# Altium schematic sheet power.SchDoc
size Letter
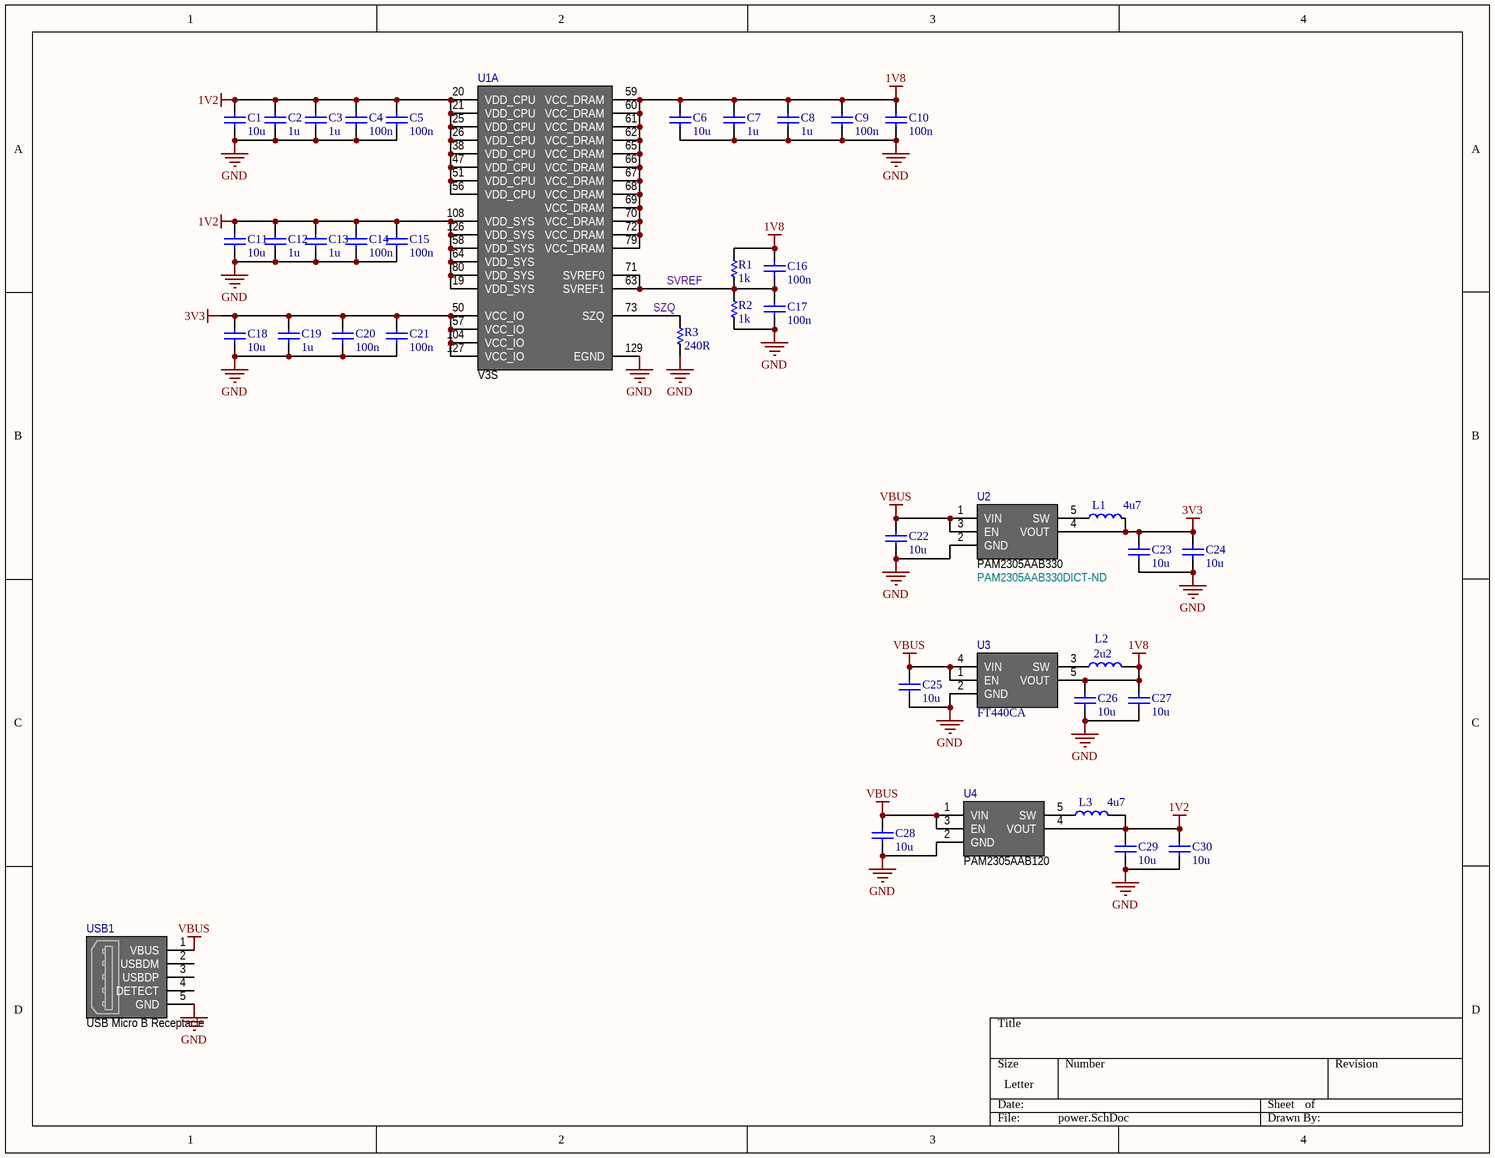
[diagram p0: power.SchDoc]

## Parts
C1  10u  [CAPC1608N]
C2  1u  [CAPC1005N]
C3  1u  [CAPC1005N]
C4  100n  [CAPC1005N]
C5  100n  [CAPC1005N]
C6  10u  [CAPC1608N]
C7  1u  [CAPC1005N]
C8  1u  [CAPC1005N]
C9  100n  [CAPC1005N]
C10  100n  [CAPC1005N]
C11  10u  [CAPC1608N]
C12  1u  [CAPC1005N]
C13  1u  [CAPC1005N]
C14  100n  [CAPC1005N]
C15  100n  [CAPC1005N]
C16  100n  [CAPC1005N]
C17  100n  [CAPC1005N]
C18  10u  [CAPC1608N]
C19  1u  [CAPC1005N]
C20  100n  [CAPC1005N]
C21  100n  [CAPC1005N]
C22  10u  [CAPC1608N]
C23  10u  [CAPC1608N]
C24  10u  [CAPC1608N]
C25  10u  [CAPC1608N]
C26  10u  [CAPC1608N]
C27  10u  [CAPC1608N]
C28  10u  [CAPC1608N]
C29  10u  [CAPC1608N]
C30  10u  [CAPC1608N]
L1  value 4u7  [INDC2520X12N]  (hidden comment: Inductor)
L2  value 2u2  [INDC2520X12N]  (hidden comment: Inductor)
L3  value 4u7  [INDC2520X12N]  (hidden comment: Inductor)
R1  1k  [RESC1005N]
R2  1k  [RESC1005N]
R3  240R  [RESC1005N]
U1  V3S  [V3S]  (part A of 10)
U2  PAM2305AAB330  Supplier Part Number 1: PAM2305AAB330DICT-ND  [TSOT25-5N]
U3  FT440CA  [SOT23-5AN]
U4  PAM2305AAB120  [TSOT25-5N]
USB1  USB Micro B Receptacle  [10118193-0001LF]

## Nets
1V2: C1.2 C2.2 C3.2 C4.2 C5.2 C11.2 C12.2 C13.2 C14.2 C15.2 C29.2 C30.2 L3.2 U1.19(VDD_SYS) U1.20(VDD_CPU) U1.21(VDD_CPU) U1.25(VDD_CPU) U1.26(VDD_CPU) U1.38(VDD_CPU) U1.47(VDD_CPU) U1.51(VDD_CPU) U1.56(VDD_CPU) U1.58(VDD_SYS) U1.64(VDD_SYS) U1.80(VDD_SYS) U1.108(VDD_SYS) U1.126(VDD_SYS) U4.4(VOUT)
1V8: C6.2 C7.2 C8.2 C9.2 C10.2 C16.2 C26.2 C27.2 L2.2 R1.2 U1.59(VCC_DRAM) U1.60(VCC_DRAM) U1.61(VCC_DRAM) U1.62(VCC_DRAM) U1.65(VCC_DRAM) U1.66(VCC_DRAM) U1.67(VCC_DRAM) U1.68(VCC_DRAM) U1.69(VCC_DRAM) U1.70(VCC_DRAM) U1.72(VCC_DRAM) U1.79(VCC_DRAM) U3.5(VOUT)
3V3: C18.2 C19.2 C20.2 C21.2 C23.2 C24.2 L1.2 U1.50(VCC_IO) U1.57(VCC_IO) U1.104(VCC_IO) U1.127(VCC_IO) U2.4(VOUT)
GND: C1.1 C2.1 C3.1 C4.1 C5.1 C6.1 C7.1 C8.1 C9.1 C10.1 C11.1 C12.1 C13.1 C14.1 C15.1 C17.1 C18.1 C19.1 C20.1 C21.1 C22.1 C23.1 C24.1 C25.1 C26.1 C27.1 C28.1 C29.1 C30.1 R2.1 R3.1 U1.129(EGND) U2.2(GND) U3.2(GND) U4.2(GND) USB1.5(GND)
VBUS: C22.2 C25.2 C28.2 U2.1(VIN) U2.3(EN) U3.1(EN) U3.4(VIN) U4.1(VIN) U4.3(EN) USB1.1(VBUS)
SVREF: C16.1 C17.2 R1.1 R2.2 U1.63(SVREF1) U1.71(SVREF0)
SZQ: R3.2 U1.73(SZQ)
NetL1_1: L1.1 U2.5(SW)
NetL2_1: L2.1 U3.3(SW)
NetL3_1: L3.1 U4.5(SW)

Not connected (* = marked no-connect by the designer): USB1 2(USBDM) 3(USBDP) 4(DETECT)

## Library data of the parts
C1-C30 = Cap Semi: Capacitor (Semiconductor SIM Model); Published: 8-Jun-2000; LatestRevisionDate: 29-May-2009; LatestRevisionNote: IPC-7351 Footprint Added.; PackageReference: C1206; Publisher: Altium Limited; PackageDescription: Chip Capacitor
L1-L3 = Inductor: Code_IEC: 1005; Published: 8-Jun-2000; LatestRevisionDate: 29-May-2009; LatestRevisionNote: IPC-7351 Footprint Added.; PackageReference: 0402-A; Publisher: Altium Limited; PackageDescription: Chip Inductor; Code_JEITA: 0402; Supplier 1: Digi-Key
  L1 L3: Supplier Part Number 1: 490-5116-1-ND
  L2: Supplier Part Number 1: SRN2512-2R2MCT-ND
R1-R3 = Res Semi: Semiconductor Resistor; Published: 8-Jun-2000; LatestRevisionDate: 17-Jul-2002; LatestRevisionNote: Re-released for DXP Platform.; PackageReference: AXIAL-0.5; Publisher: Altium Limited; PackageDescription: Axial Device, Thru-Hole; 2 Leads; 0.5 in Pin Spacing
U2 = PAM2305AAB330: IC REG BUCK 3.3V 1A SYNC TSOT25; Manufacturer: Diodes Incorporated; Function: Step-Down; Output Configuration: Positive; Output Type: Fixed; Number of Outputs: 1; Voltage - Input (Min): 2.5V; Voltage - Input (Max): 5.5V; Frequency - Switching: 1.5MHz; Synchronous Rectifier: Yes; Supplier 1: Digi-Key; Manufacturer Part Number: PAM2305AAB330; RoHS: RoHS Compliant; Category: Integrated Circuits (ICs); Stock 1: 8179; Pricing 1: 1=0.58, 10=0.51, 100=0.39, 500=0.309, 1000=0.2475 (USD); Packaging: Cut Tape (CT); Topology: Buck; Voltage - Output (Min/Fixed): 3.3V; Voltage - Output (Max): -; Current - Output: 1A; Operating Temperature: -40°C ~ 85°C (TA); Mounting Type: Surface Mount; Package / Case: SOT-23-5 Thin, TSOT-23-5; Supplier Device Package: TSOT-25; ComponentLink1URL: http://www.diodes.com/_files/datasheets/PAM2305.pdf; ComponentLink1Description: http://www.diodes.com/_files/datasheets/PAM2305.pdf
U3 = FT440CA: IC REG BUCK 1.8V 0.6A SYNC SOT23; Manufacturer: Fremont Micro Devices USA; Function: Step-Down; Output Configuration: Positive; Output Type: Fixed; Number of Outputs: 1; Voltage - Input (Min): 2.5V; Voltage - Input (Max): 5.5V; Current - Output: 600mA; Frequency - Switching: 1.5MHz; Synchronous Rectifier: Yes; Supplier 1: Digi-Key; Manufacturer Part Number: FT440CA; RoHS: RoHS Compliant; Category: Integrated Circuits (ICs); Stock 1: 15555; Pricing 1: 1=0.54, 10=0.42, 25=0.3544, 100=0.2888, 250=0.2392, 500=0.1976, 750=0.1648, 1000=0.148 (USD); Packaging: Cut Tape (CT); Topology: Buck; Voltage - Output (Min/Fixed): 1.8V; Voltage - Output (Max): -; Operating Temperature: -40°C ~ 85°C (TA); Mounting Type: Surface Mount; Package / Case: SC-74A, SOT-753; Supplier Device Package: SOT-23-5; ComponentLink1URL: http://www.fremontmicrousa.com/pdf/FT440%20datasheet.pdf; ComponentLink1Description: http://www.fremontmicrousa.com/pdf/FT440%20datasheet.pdf; Supplier Part Number 1: 1219-1077-1-ND
U4 = PAM2305AAB120: IC REG BUCK 1.2V 1A SYNC TSOT25; Manufacturer: Diodes Incorporated; Function: Step-Down; Output Configuration: Positive; Output Type: Fixed; Number of Outputs: 1; Voltage - Input (Min): 2.5V; Voltage - Input (Max): 5.5V; Frequency - Switching: 1.5MHz; Synchronous Rectifier: Yes; Supplier 1: Digi-Key; Manufacturer Part Number: PAM2305AAB120; RoHS: RoHS Compliant; Category: Integrated Circuits (ICs); Stock 1: 2950; Pricing 1: 1=0.58, 10=0.51, 100=0.3909, 500=0.309, 1000=0.2472 (USD); Packaging: Cut Tape (CT); Part Status: Active; Topology: Buck; Voltage - Output (Min/Fixed): 1.2V; Voltage - Output (Max): -; Current - Output: 1A; Operating Temperature: -40°C ~ 85°C (TA); Mounting Type: Surface Mount; Package / Case: SOT-23-5 Thin, TSOT-23-5; Supplier Device Package: TSOT-25; ComponentLink1URL: https://www.diodes.com/assets/Datasheets/PAM2305.pdf; ComponentLink1Description: https://www.diodes.com/assets/Datasheets/PAM2305.pdf; Supplier Part Number 1: PAM2305AAB120DICT-ND